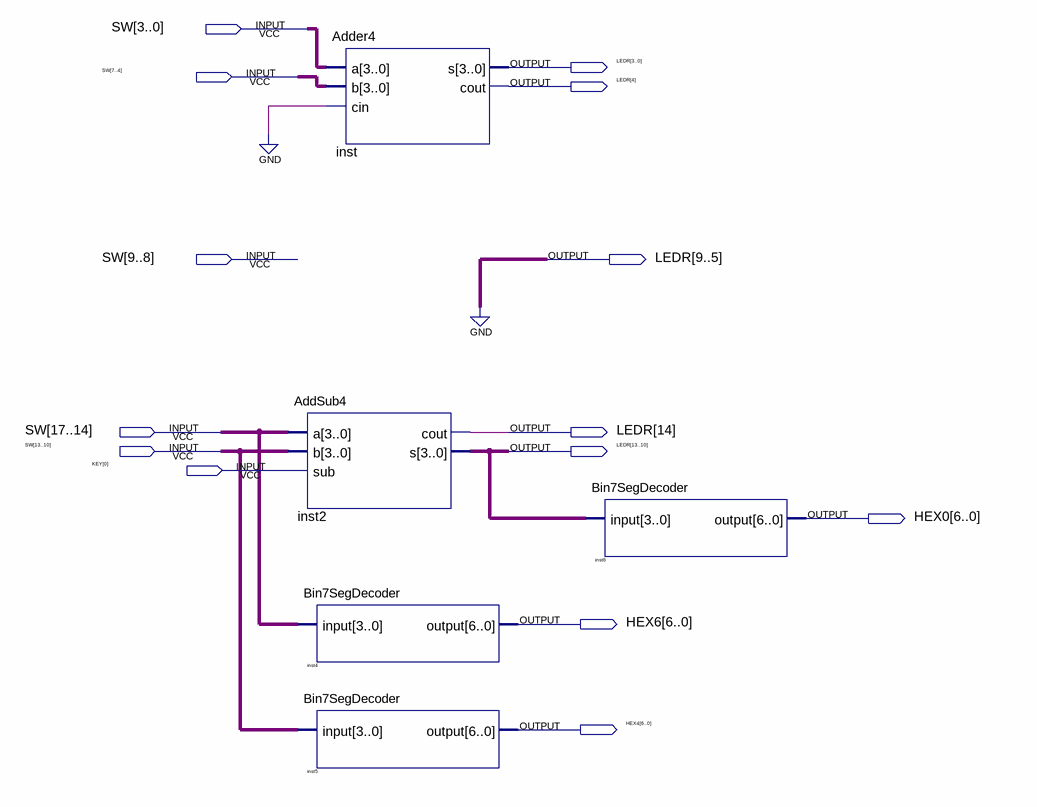
[diagram p0: schematic sheet]
// Quartus schematic AdderDemo.bdf as structural Verilog: 5 symbols, 14 pins
module AdderDemo (
  input  [17:0] SW,
  input  [0:0] KEY,
  output [14:0] LEDR,
  output [6:0] HEX0,
  output [6:0] HEX6,
  output [6:0] HEX4
);

  Adder4 inst (.a(SW[3:0]), .b(SW[7:4]), .cin(1'b0), .s(LEDR[3:0]), .cout(LEDR[4]));
  AddSub4 inst2 (.a(SW[17:14]), .b(SW[13:10]), .sub(KEY[0]), .cout(LEDR[14]), .s(LEDR[13:10]));
  Bin7SegDecoder inst4 (.\input (SW[17:14]), .\output (HEX6));
  Bin7SegDecoder inst5 (.\input (SW[13:10]), .\output (HEX4));
  Bin7SegDecoder inst6 (.\input (LEDR[13:10]), .\output (HEX0));

  assign LEDR[9:5] = {5{1'b0}};
endmodule
